# EAGLE design tester_board (EAGLE 9.6.2)
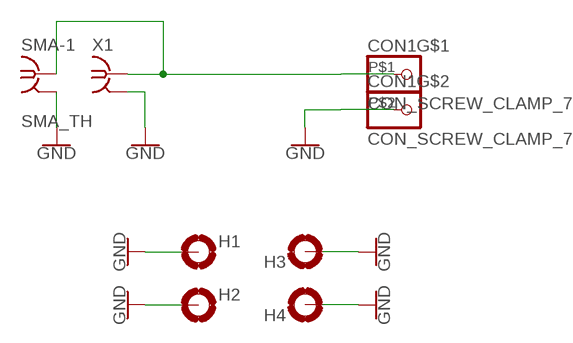
[diagram p0: schematic, sheet 1]

## Parts
CON1  CON_SCREW_CLAMP_7MM  [CON_SCREW_CLAMP_7MM]
H1  MOUNT-PAD-ROUND3.0  [3,0-PAD]
H2  MOUNT-PAD-ROUND3.0  [3,0-PAD]
H3  MOUNT-PAD-ROUND3.0  [3,0-PAD]
H4  MOUNT-PAD-ROUND3.0  [3,0-PAD]
SMA-1  SMA_TH  [BU-SMA-V]
X1  SMA-142-0711-821/826  [J502-ND-142-0711-821/826]

## Nets
GND: CON1.P$2 H1.B3,0(MOUNT) H2.B3,0(MOUNT) H3.B3,0(MOUNT) H4.B3,0(MOUNT) SMA-1.2(GND) SMA-1.3(GND) SMA-1.4(GND) SMA-1.5(GND) X1.G@1 X1.G@2 X1.G@3 X1.G@4
N$1: CON1.P$1 SMA-1.1 X1.1

## Library data of the parts
CON1 = mylib:CON_SCREW_CLAMP_7MM
H1-H4 = holes:MOUNT-PAD-ROUND: MOUNTING PAD, round
SMA-1 = mylib:SMA_TH
X1 = con-coax:SMA-: SMA 50 Ohm End Launch Jack Receptacle - Round Contact Johnson Components Source: www.johnsoncomponents.com .. J502-ND.pdf; MF: JOHNSON COMPONENTS; MPN: 142-0711-821; OC_FARNELL: 1019328; OC_NEWARK: 16F3627

## Board
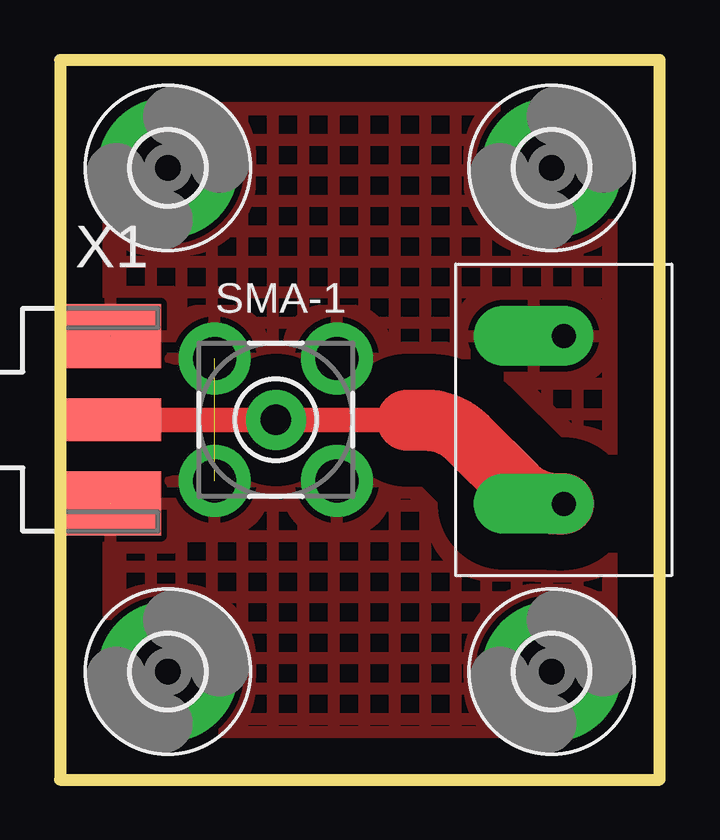
[diagram p1: board, top side]
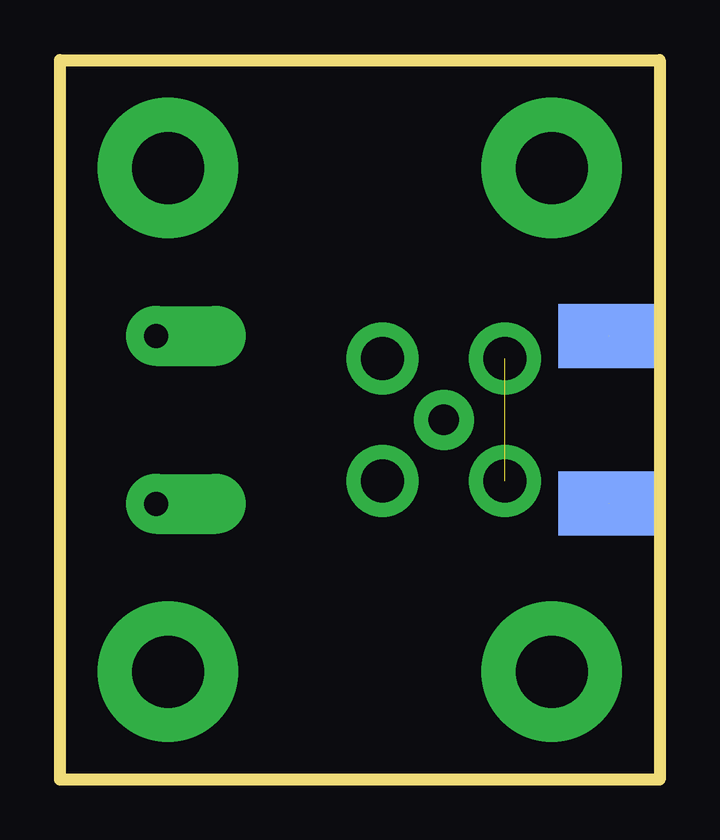
[diagram p2: board, bottom side, seen from below]

Size 25 x 30 mm. Coordinates in mm from the lower left corner, seen from the top.
Outline: 0,0 25,0 25,30 0,30 0,0
Copper layers (1*16): Top 0.035mm / dielectric 1.5mm / Bottom 0.035mm
Design rules "default": minimum track width 6mil, minimum drill 0.35mm, track to track 6mil, track to pad 6mil, pad to pad 6mil, via to via 6mil, smd to smd 6mil, copper to edge 40mil, drill to drill 6mil, minimum pad ring 10mil, minimum via ring 8mil, stop-mask expansion 4mil, vias tented up to drill 0mil, thermal gap 10mil

### Footprints (pad centres in the part's own frame; a part is rotated, then mirrored left to right if it is on the bottom)
CON_SCREW_CLAMP_7MM = drill 1 pad 2.5 offset: P$1 -3.5,0; P$2 3.5,0
3,0-PAD = drill 3 pad 5.842: B3,0 0,0
BU-SMA-V = drill 1.27 pad 2.5: 1 0,0 | drill 1.778 pad 3: 2 -2.55,2.55; 3 2.55,2.55; 4 2.55,-2.55; 5 -2.55,-2.55
J502-ND-142-0711-821/826 = smd 4.191 x 1.778: 1 2.115,0 | smd 4.191 x 2.667: G@1 2.115,3.495; G@2 2.115,-3.495 | smd 4.191 x 2.667 bottom: G@3 2.115,3.495; G@4 2.115,-3.495

### Placement (x,y rotation side)
CON1  21,15 90 top
H1  4.5,4.5 0 top
H2  4.5,25.5 0 top
H3  20.5,25.5 0 top
H4  20.5,4.5 0 top
SMA-1  9,15 0 top
X1  0,15 0 top

### Tracks (layer width: path | path; a pad name or v marks a point on that pad's centre or on a via)
GND  (3 unrouted)
  pour Top (isolate 1.5, hatched): -1.27,31.75 -1.27,-1.27 26.67,-1.27 26.67,31.75
N$1
  Top 1.016: X1.1 SMA-1.1 14.48,15 14.48,14.99
  Top 2.54: 14.48,14.99 15.24,14.99 arc-45 16.97,14.27 19.04,12.2 arc45 20.73,11.5 CON1.P$1